# Altium schematic sheet MCU.SchDoc
size A4
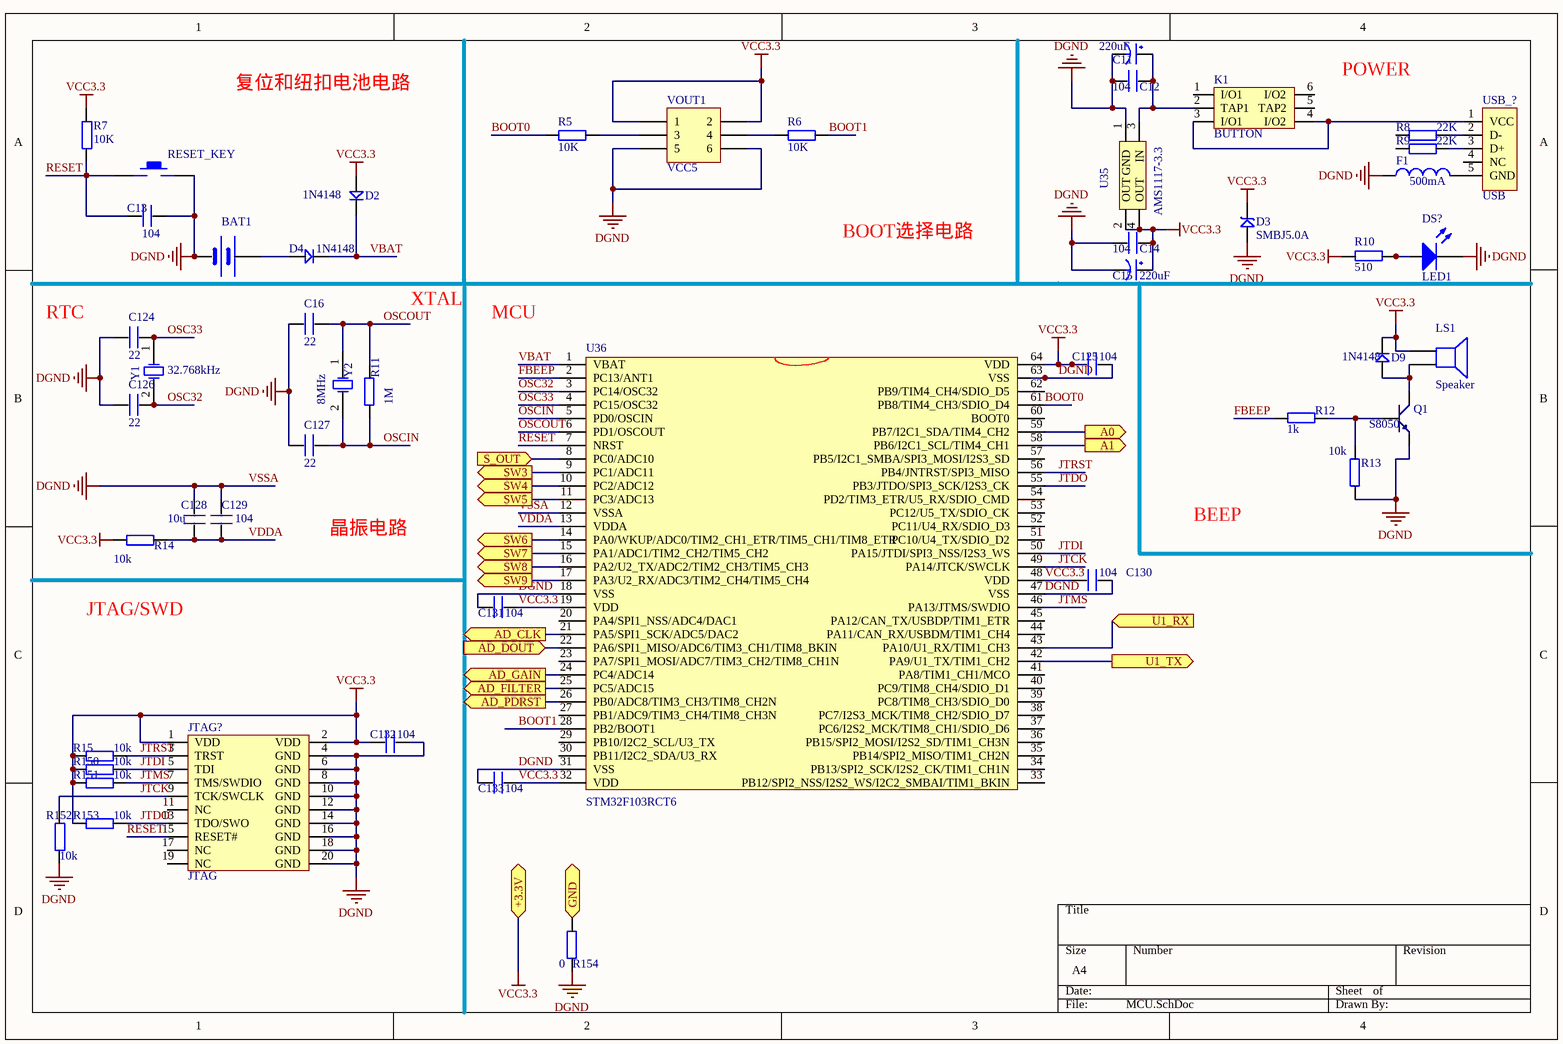
[diagram p0: MCU.SchDoc]

## Parts
BAT1  BATT  [BATM]  (value not drawn)
C11  220uF  [CC6.56.5]
C12  104  [0603P]
C13  104  [0603P]
C14  104  [0603P]
C15  220uF  [CC6.56.5]
C16  22  [0603P]
C124  22  [0603P]
C125  104  [0603P]
C126  22  [0603P]
C127  22  [0603P]
C128  10u  [0603P]
C129  104  [0603P]
C130  104  [0603P]
C131  104  [0603P]
C132  104  [0603P]
C133  104  [0603P]
D2  1N4148  [DIODE_SOP]
D3  SMBJ5.0A  [SMBJ]
D4  1N4148  [DIODE_SOP]
D9  1N4148  [DIODE_SOP]
DS?  LED1  [SMDLED]
F1  value 500mA  [0402-A]  (hidden comment: Inductor)
JTAG?  JTAG  [JTAG_20]
K1  BUTTON  [BTN8.5*8.5]
LS1  Speaker  [PIN2]
Q1  S8050  [SOT-23R]
R5  10K  [0603P]
R6  10K  [0603P]
R7  10K  [0603P]
R8  22K  [0603P]
R9  22K  [0603P]
R10  510  [0603P]
R11  1M  [0603P]
R12  1k  [0603P]
R13  10k  [0603P]
R14  10k  [0603P]
R15  10k  [0603P]
R150  10k  [0603P]
R151  10k  [0603P]
R152  10k  [0603P]
R153  10k  [0603P]
R154  0  [0603P]
RESET_KEY  KEY_M  [KEY_M]  (value not drawn)
U35  AMS1117-3.3  [AMS1117]
U36  STM32F103RCT6  [LQFP64]
USB_?  USB  [USB/SM0.8-6H5]
VOUT1  VCC5  [HDR2X3]
Y1  32.768kHz  [XTAL_US]
Y2  8MHz  [XTAL_US]

## Ports
+3.3V, A0 (out), A1 (out), AD_CLK (out), AD_DOUT (in), AD_FILTER (out), AD_GAIN (out), AD_PDRST (out), GND, S_OUT (in), SW3 (out), SW4 (out), SW5 (out), SW6 (out), SW7 (out), SW8 (out), SW9 (out), U1_RX (in), U1_TX (out)

## Nets
DGND: BAT1.2(GND) C11.2(GND) C12.2 C13.2 C14.2 C15.2(GND) C16.1 C124.1 C125.2 C126.1 C127.2 C128.2 C129.2 C130.2 C131.1 C132.2 C133.1 D3.1 DS?.2(K) F1.1 JTAG?.4(GND) JTAG?.6(GND) JTAG?.8(GND) JTAG?.10(GND) JTAG?.12(GND) JTAG?.14(GND) JTAG?.16(GND) JTAG?.18(GND) JTAG?.20(GND) Q1.1(E) R13.2 R152.1 R154.2 RESET_KEY.2 U35.1(GND) U36.12(VSSA) U36.18(VSS) U36.31(VSS) U36.47(VSS) U36.63(VSS) VOUT1.5 VOUT1.6  [also labelled VSSA]
VCC3.3: C14.1 C15.1(VCC) C125.1 C130.1 C131.2 C132.1 C133.2 D2.1 D3.2 D9.2 JTAG?.1(VDD) JTAG?.2(VDD) LS1.1 R7.2 R10.2 R14.1 R15.1 R150.1 R151.1 R153.1 U35.2(OUT) U35.4(OUT) U36.19(VDD) U36.32(VDD) U36.48(VDD) U36.64(VDD) VOUT1.1 VOUT1.2 ; port +3.3V
A0: U36.59(PB7/I2C1_SDA/TIM4_CH2) ; port A0
A1: U36.58(PB6/I2C1_SCL/TIM4_CH1) ; port A1
AD_CLK: U36.21(PA5/SPI1_SCK/ADC5/DAC2) ; port AD_CLK
AD_DOUT: U36.22(PA6/SPI1_MISO/ADC6/TIM3_CH1/TIM8_BKIN) ; port AD_DOUT
AD_FILTER: U36.25(PC5/ADC15) ; port AD_FILTER
AD_GAIN: U36.24(PC4/ADC14) ; port AD_GAIN
AD_PDRST: U36.26(PB0/ADC8/TIM3_CH3/TIM8_CH2N) ; port AD_PDRST
BOOT0: R5.1 U36.61(PB8/TIM4_CH3/SDIO_D4)
BOOT1: R6.2 U36.28(PB2/BOOT1)
FBEEP: R12.2 U36.2(PC13/ANT1)
GND: R154.1 ; port GND
JTCK: JTAG?.9(TCK/SWCLK) R152.2 U36.49(PA14/JTCK/SWCLK)
JTDI: JTAG?.5(TDI) R150.2 U36.50(PA15/JTDI/SPI3_NSS/I2S3_WS)
JTDO: JTAG?.13(TDO/SWO) R153.2 U36.55(PB3/JTDO/SPI3_SCK/I2S3_CK)
JTMS: JTAG?.7(TMS/SWDIO) R151.2 U36.46(PA13/JTMS/SWDIO)
JTRST: JTAG?.3(TRST) R15.2 U36.56(PB4/JNTRST/SPI3_MISO)
OSC32: C126.2 U36.3(PC14/OSC32) Y1.2(OSC2)
OSC33: C124.2 U36.4(PC15/OSC32) Y1.1(OSC1)
OSCIN: C127.1 R11.2 U36.5(PD0/OSCIN) Y2.2(OSC2)
OSCOUT: C16.2 R11.1 U36.6(PD1/OSCOUT) Y2.1(OSC1)
RESET: C13.1 JTAG?.15(RESET#) R7.1 RESET_KEY.1 U36.7(NRST)
S_OUT: U36.8(PC0/ADC10) ; port S_OUT
SW3: U36.9(PC1/ADC11) ; port SW3
SW4: U36.10(PC2/ADC12) ; port SW4
SW5: U36.11(PC3/ADC13) ; port SW5
SW6: U36.14(PA0/WKUP/ADC0/TIM2_CH1_ETR/TIM5_CH1/TIM8_ETR) ; port SW6
SW7: U36.15(PA1/ADC1/TIM2_CH2/TIM5_CH2) ; port SW7
SW8: U36.16(PA2/U2_TX/ADC2/TIM2_CH3/TIM5_CH3) ; port SW8
SW9: U36.17(PA3/U2_RX/ADC3/TIM2_CH4/TIM5_CH4) ; port SW9
U1_RX: U36.43(PA10/U1_RX/TIM1_CH3) ; port U1_RX
U1_TX: U36.42(PA9/U1_TX/TIM1_CH2) ; port U1_TX
VBAT: D2.2 D4.2 U36.1(VBAT)
VDDA: C128.1 C129.1 R14.2 U36.13(VDDA)
NetBAT1_1: BAT1.1(VCC) D4.1
NetC11_1: C11.1(VCC) C12.1 K1.2(TAP1) U35.3(IN)
NetD9_1: D9.1 LS1.2 Q1.3(C)
NetDS?_1: DS?.1(A) R10.1
NetF1_2: F1.2 USB_?.5(GND)
NetK1_3: K1.3(I/O1) K1.4(I/O2) USB_?.1(VCC)
NetQ1_2: Q1.2(B) R12.1 R13.1
NetR5_2: R5.2 VOUT1.3
NetR6_1: R6.1 VOUT1.4
NetR8_2: R8.2 USB_?.2(D-)
NetR9_2: R9.2 USB_?.3(D+)

Not connected (* = marked no-connect by the designer): JTAG? 11(NC) 17(NC) 19(NC); K1 1(I/O1) 5(TAP2) 6(I/O2); R8 1; R9 1; U36 20(PA4/SPI1_NSS/ADC4/DAC1) 23(PA7/SPI1_MOSI/ADC7/TIM3_CH2/TIM8_CH1N) 27(PB1/ADC9/TIM3_CH4/TIM8_CH3N) 29(PB10/I2C2_SCL/U3_TX) 30(PB11/I2C2_SDA/U3_RX) 33(PB12/SPI2_NSS/I2S2_WS/I2C2_SMBAI/TIM1_BKIN) 34(PB13/SPI2_SCK/I2S2_CK/TIM1_CH1N) 35(PB14/SPI2_MISO/TIM1_CH2N) 36(PB15/SPI2_MOSI/I2S2_SD/TIM1_CH3N) 37(PC6/I2S2_MCK/TIM8_CH1/SDIO_D6) 38(PC7/I2S3_MCK/TIM8_CH2/SDIO_D7) 39(PC8/TIM8_CH3/SDIO_D0) 40(PC9/TIM8_CH4/SDIO_D1) 41(PA8/TIM1_CH1/MCO) 44(PA11/CAN_RX/USBDM/TIM1_CH4) 45(PA12/CAN_TX/USBDP/TIM1_ETR) 51(PC10/U4_TX/SDIO_D2) 52(PC11/U4_RX/SDIO_D3) 53(PC12/U5_TX/SDIO_CK) 54(PD2/TIM3_ETR/U5_RX/SDIO_CMD) 57(PB5/I2C1_SMBA/SPI3_MOSI/I2S3_SD) 60(BOOT0) 62(PB9/TIM4_CH4/SDIO_D5); USB_? 4(NC)

## Notes on the sheet
- 复位和纽扣电池电路
- POWER
- BOOT选择电路
- RTC
- XTAL
- MCU
- BEEP
- 晶振电路
- JTAG/SWD

## Library data of the parts
BAT1 = BAT
C11 C15 = CAP
C12-C14 C16 C124-C133 = C
D2 D4 D9 = D
D3 = SMBJ: TVS
DS? = LED2: Typical RED, GREEN, YELLOW, AMBER GaAs LED; Published: 8-Jun-2000; LatestRevisionDate: 17-Jul-2002; LatestRevisionNote: Re-released for DXP Platform.; PackageDocument: Feb-2002; PackageReference: 3.2X1.6X1.1; Publisher: Altium Limited
F1 = Inductor: Code_IEC: 1005; Published: 8-Jun-2000; LatestRevisionDate: 17-Jul-2002; LatestRevisionNote: Re-released for DXP Platform.; PackageReference: 0402-A; Publisher: Altium Limited; Code_JEITA: 0402
LS1 = Speaker: Loudspeaker; Published: 24-Mar-1999; LatestRevisionDate: 17-Jul-2002; LatestRevisionNote: Re-released for DXP Platform.; PackageReference: PIN2; Publisher: Altium Limited
Q1 = NPN: 8050/BCW846/BCW847
R5-R15 R150-R154 = R
U35 = AMS1117
U36 = STM32F103RDT6
USB_? = USB5
VOUT1 = Header 3X2: Header, 3-Pin, Dual row; LatestRevisionDate: 17-Jul-2002; LatestRevisionNote: Re-released for DXP Platform.; Publisher: Altium Limited
Y1 Y2 = XTAL: Crystal Oscillator; Published: 8-Jun-2000; LatestRevisionDate: 17-Jul-2002; LatestRevisionNote: Re-released for DXP Platform.; Publisher: Altium Limited